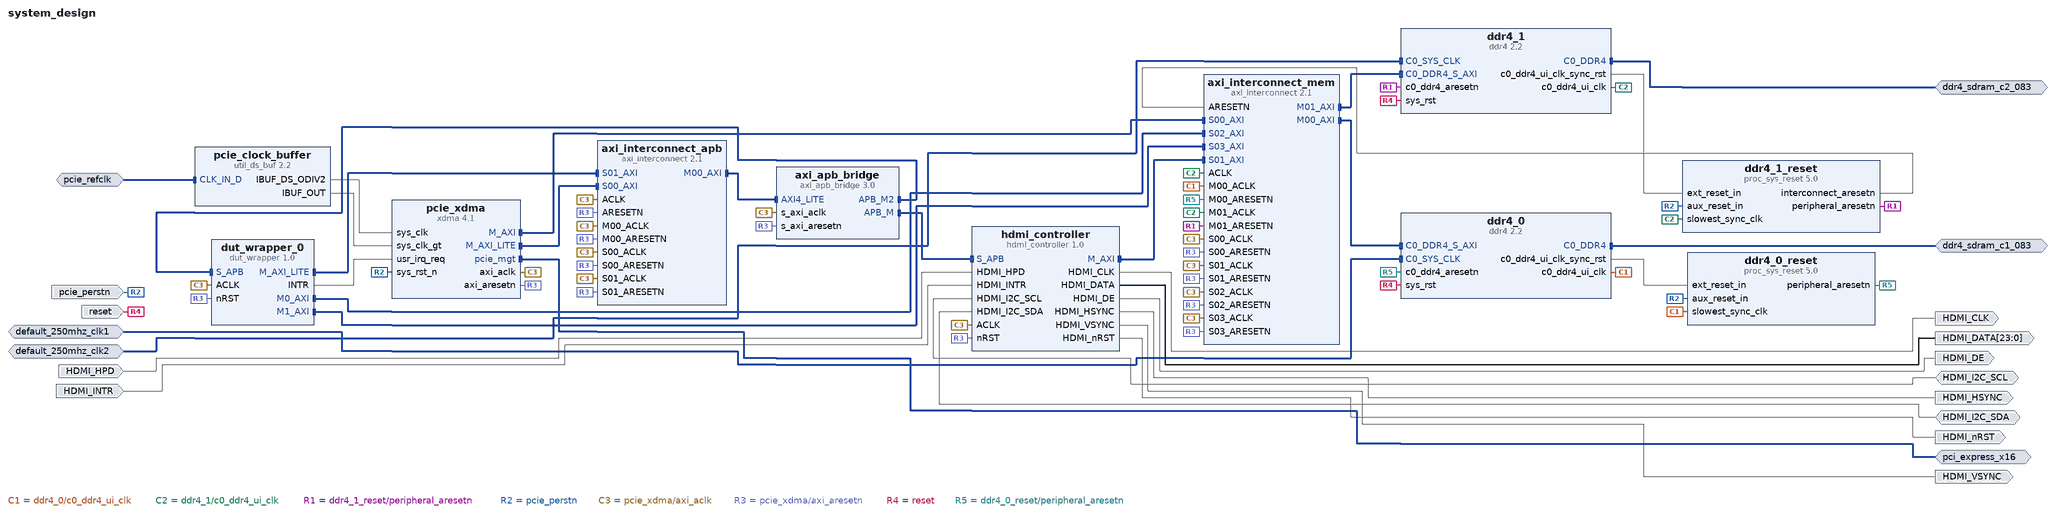
[diagram p0: block diagram of the top level]
# Vivado block design system_design, xcvu9p-flga2104-2L-e, Vivado 2024.2
create_bd_design system_design

create_bd_intf_port -mode Slave -vlnv xilinx.com:interface:diff_clock_rtl:1.0 pcie_refclk
set_property -dict {CONFIG.FREQ_HZ 100000000} [get_bd_intf_ports pcie_refclk]
create_bd_intf_port -mode Master -vlnv xilinx.com:interface:pcie_7x_mgt_rtl:1.0 pci_express_x16
create_bd_intf_port -mode Slave -vlnv xilinx.com:interface:diff_clock_rtl:1.0 default_250mhz_clk1
set_property -dict {CONFIG.FREQ_HZ 250000000} [get_bd_intf_ports default_250mhz_clk1]
create_bd_intf_port -mode Slave -vlnv xilinx.com:interface:diff_clock_rtl:1.0 default_250mhz_clk2
set_property -dict {CONFIG.FREQ_HZ 250000000} [get_bd_intf_ports default_250mhz_clk2]
create_bd_intf_port -mode Master -vlnv xilinx.com:interface:ddr4_rtl:1.0 ddr4_sdram_c1_083
create_bd_intf_port -mode Master -vlnv xilinx.com:interface:ddr4_rtl:1.0 ddr4_sdram_c2_083
create_bd_port -dir I -type rst pcie_perstn
set_property -dict {CONFIG.POLARITY ACTIVE_LOW} [get_bd_ports pcie_perstn]
create_bd_port -dir I -type rst reset
set_property -dict {CONFIG.POLARITY ACTIVE_HIGH} [get_bd_ports reset]
create_bd_port -dir I HDMI_INTR
create_bd_port -dir I HDMI_HPD
create_bd_port -dir O HDMI_nRST
create_bd_port -dir IO HDMI_I2C_SCL
create_bd_port -dir IO HDMI_I2C_SDA
create_bd_port -dir O HDMI_CLK
create_bd_port -dir O HDMI_DE
create_bd_port -dir O HDMI_HSYNC
create_bd_port -dir O HDMI_VSYNC
create_bd_port -dir O -from 23 -to 0 HDMI_DATA

create_bd_cell -type ip -vlnv xilinx.com:ip:xdma:4.1 pcie_xdma
set_property -dict [list \
  CONFIG.PCIE_BOARD_INTERFACE pci_express_x16 \
  CONFIG.PF0_DEVICE_ID_mqdma 903F \
  CONFIG.PF0_SRIOV_VF_DEVICE_ID A03F \
  CONFIG.PF2_DEVICE_ID_mqdma 923F \
  CONFIG.PF3_DEVICE_ID_mqdma 933F \
  CONFIG.SYS_RST_N_BOARD_INTERFACE pcie_perstn \
  CONFIG.axi_data_width 512_bit \
  CONFIG.axil_master_64bit_en false \
  CONFIG.axilite_master_en true \
  CONFIG.axilite_master_size 1 \
  CONFIG.axist_bypass_en false \
  CONFIG.axisten_freq 250 \
  CONFIG.cfg_mgmt_if false \
  CONFIG.mode_selection Advanced \
  CONFIG.pf0_base_class_menu Memory_controller \
  CONFIG.pf0_class_code_base 05 \
  CONFIG.pf0_class_code_interface 00 \
  CONFIG.pf0_class_code_sub 80 \
  CONFIG.pf0_device_id 7022 \
  CONFIG.pf0_msi_enabled false \
  CONFIG.pf0_sub_class_interface_menu Other_memory_controller \
  CONFIG.pf0_subsystem_id 2D3D \
  CONFIG.pf0_subsystem_vendor_id C10E \
  CONFIG.pl_link_cap_max_link_speed 8.0_GT/s \
  CONFIG.plltype QPLL1 \
  CONFIG.xdma_num_usr_irq 1 \
  CONFIG.xdma_pcie_64bit_en true \
  CONFIG.xdma_rnum_chnl 4 \
  CONFIG.xdma_wnum_chnl 4 \
] [get_bd_cells pcie_xdma]
create_bd_cell -type ip -vlnv xilinx.com:ip:util_ds_buf:2.2 pcie_clock_buffer
set_property -dict {CONFIG.DIFF_CLK_IN_BOARD_INTERFACE pcie_refclk CONFIG.USE_BOARD_FLOW true} [get_bd_cells pcie_clock_buffer]
create_bd_cell -type ip -vlnv xilinx.com:ip:ddr4:2.2 ddr4_0
set_property -dict [list \
  CONFIG.ADDN_UI_CLKOUT1_FREQ_HZ None \
  CONFIG.C0.BANK_GROUP_WIDTH 1 \
  CONFIG.C0.DDR4_AxiAddressWidth 31 \
  CONFIG.C0.DDR4_SAVE_RESTORE false \
  CONFIG.C0.DDR4_SELF_REFRESH false \
  CONFIG.C0_CLOCK_BOARD_INTERFACE default_250mhz_clk1 \
  CONFIG.C0_DDR4_BOARD_INTERFACE ddr4_sdram_c1_083 \
  CONFIG.RESET_BOARD_INTERFACE reset \
] [get_bd_cells ddr4_0]
create_bd_cell -type ip -vlnv xilinx.com:ip:proc_sys_reset:5.0 ddr4_0_reset
create_bd_cell -type ip -vlnv xilinx.com:ip:ddr4:2.2 ddr4_1
set_property -dict [list \
  CONFIG.ADDN_UI_CLKOUT1_FREQ_HZ None \
  CONFIG.C0.BANK_GROUP_WIDTH 1 \
  CONFIG.C0.DDR4_AxiAddressWidth 31 \
  CONFIG.C0_CLOCK_BOARD_INTERFACE default_250mhz_clk2 \
  CONFIG.C0_DDR4_BOARD_INTERFACE ddr4_sdram_c2_083 \
  CONFIG.RESET_BOARD_INTERFACE reset \
] [get_bd_cells ddr4_1]
create_bd_cell -type ip -vlnv xilinx.com:ip:proc_sys_reset:5.0 ddr4_1_reset
create_bd_cell -type ip -vlnv xilinx.com:ip:axi_interconnect:2.1 axi_interconnect_mem
set_property -dict [list \
  CONFIG.ENABLE_ADVANCED_OPTIONS 0 \
  CONFIG.M00_HAS_DATA_FIFO 1 \
  CONFIG.M00_HAS_REGSLICE 1 \
  CONFIG.M01_HAS_DATA_FIFO 1 \
  CONFIG.M01_HAS_REGSLICE 1 \
  CONFIG.NUM_MI 2 \
  CONFIG.NUM_SI 4 \
  CONFIG.S00_HAS_DATA_FIFO 1 \
  CONFIG.S00_HAS_REGSLICE 1 \
  CONFIG.S01_HAS_DATA_FIFO 1 \
  CONFIG.S01_HAS_REGSLICE 1 \
  CONFIG.S02_HAS_DATA_FIFO 1 \
  CONFIG.S02_HAS_REGSLICE 1 \
  CONFIG.S03_HAS_DATA_FIFO 1 \
  CONFIG.S03_HAS_REGSLICE 1 \
] [get_bd_cells axi_interconnect_mem]
create_bd_cell -type ip -vlnv xilinx.com:ip:axi_apb_bridge:3.0 axi_apb_bridge
set_property -dict {CONFIG.C_APB_NUM_SLAVES 2 CONFIG.C_M_APB_PROTOCOL apb3} [get_bd_cells axi_apb_bridge]
create_bd_cell -type ip -vlnv xilinx.com:user:dut_wrapper:1.0 dut_wrapper_0
set_property -dict [list \
  CONFIG.C_CLKIN_PERIOD 4 \
  CONFIG.C_M_AXILITE_ADDR_WIDTH 20 \
  CONFIG.C_M_AXI_ADDR_WIDTH 36 \
] [get_bd_cells dut_wrapper_0]
create_bd_cell -type ip -vlnv xilinx.com:user:hdmi_controller:1.0 hdmi_controller
set_property -dict {CONFIG.C_M_AXI_ADDR_WIDTH 36} [get_bd_cells hdmi_controller]
create_bd_cell -type ip -vlnv xilinx.com:ip:axi_interconnect:2.1 axi_interconnect_apb
set_property -dict {CONFIG.NUM_MI 1 CONFIG.NUM_SI 2} [get_bd_cells axi_interconnect_apb]

# ---- connections ----

connect_bd_intf_net [get_bd_intf_pins axi_interconnect_apb/S00_AXI] [get_bd_intf_pins pcie_xdma/M_AXI_LITE]
connect_bd_intf_net [get_bd_intf_pins axi_interconnect_mem/S01_AXI] [get_bd_intf_pins hdmi_controller/M_AXI]
connect_bd_intf_net [get_bd_intf_pins axi_apb_bridge/APB_M] [get_bd_intf_pins hdmi_controller/S_APB]
connect_bd_intf_net [get_bd_intf_pins dut_wrapper_0/S_APB] [get_bd_intf_pins axi_apb_bridge/APB_M2]
connect_bd_intf_net -intf_net axi_interconnect_0_M00_AXI [get_bd_intf_pins axi_interconnect_mem/M00_AXI] [get_bd_intf_pins ddr4_0/C0_DDR4_S_AXI]
connect_bd_intf_net -intf_net axi_interconnect_0_M00_AXI1 [get_bd_intf_pins axi_interconnect_apb/M00_AXI] [get_bd_intf_pins axi_apb_bridge/AXI4_LITE]
connect_bd_intf_net -intf_net axi_interconnect_0_M01_AXI [get_bd_intf_pins axi_interconnect_mem/M01_AXI] [get_bd_intf_pins ddr4_1/C0_DDR4_S_AXI]
connect_bd_intf_net [get_bd_intf_ports ddr4_sdram_c1_083] [get_bd_intf_pins ddr4_0/C0_DDR4]
connect_bd_intf_net [get_bd_intf_ports ddr4_sdram_c2_083] [get_bd_intf_pins ddr4_1/C0_DDR4]
connect_bd_intf_net -intf_net default_250mhz_clk1_1 [get_bd_intf_ports default_250mhz_clk1] [get_bd_intf_pins ddr4_0/C0_SYS_CLK]
connect_bd_intf_net -intf_net default_250mhz_clk2_1 [get_bd_intf_ports default_250mhz_clk2] [get_bd_intf_pins ddr4_1/C0_SYS_CLK]
connect_bd_intf_net [get_bd_intf_pins dut_wrapper_0/M0_AXI] [get_bd_intf_pins axi_interconnect_mem/S02_AXI]
connect_bd_intf_net [get_bd_intf_pins dut_wrapper_0/M1_AXI] [get_bd_intf_pins axi_interconnect_mem/S03_AXI]
connect_bd_intf_net [get_bd_intf_pins dut_wrapper_0/M_AXI_LITE] [get_bd_intf_pins axi_interconnect_apb/S01_AXI]
connect_bd_intf_net [get_bd_intf_ports pcie_refclk] [get_bd_intf_pins pcie_clock_buffer/CLK_IN_D]
connect_bd_intf_net [get_bd_intf_pins pcie_xdma/M_AXI] [get_bd_intf_pins axi_interconnect_mem/S00_AXI]
connect_bd_intf_net [get_bd_intf_ports pci_express_x16] [get_bd_intf_pins pcie_xdma/pcie_mgt]
connect_bd_net -net HDMI_HPD_0_1 [get_bd_ports HDMI_HPD] [get_bd_pins hdmi_controller/HDMI_HPD]
connect_bd_net -net HDMI_INTR_0_1 [get_bd_ports HDMI_INTR] [get_bd_pins hdmi_controller/HDMI_INTR]
connect_bd_net [get_bd_ports HDMI_I2C_SCL] [get_bd_pins hdmi_controller/HDMI_I2C_SCL]
connect_bd_net [get_bd_ports HDMI_I2C_SDA] [get_bd_pins hdmi_controller/HDMI_I2C_SDA]
connect_bd_net [get_bd_pins ddr4_0/c0_ddr4_ui_clk] [get_bd_pins axi_interconnect_mem/M00_ACLK] [get_bd_pins ddr4_0_reset/slowest_sync_clk]
connect_bd_net [get_bd_pins ddr4_0/c0_ddr4_ui_clk_sync_rst] [get_bd_pins ddr4_0_reset/ext_reset_in]
connect_bd_net [get_bd_pins ddr4_1/c0_ddr4_ui_clk] \
  [get_bd_pins axi_interconnect_mem/ACLK] [get_bd_pins axi_interconnect_mem/M01_ACLK] \
  [get_bd_pins ddr4_1_reset/slowest_sync_clk]
connect_bd_net [get_bd_pins ddr4_1/c0_ddr4_ui_clk_sync_rst] [get_bd_pins ddr4_1_reset/ext_reset_in]
connect_bd_net [get_bd_pins ddr4_1_reset/interconnect_aresetn] [get_bd_pins axi_interconnect_mem/ARESETN]
connect_bd_net [get_bd_pins ddr4_1_reset/peripheral_aresetn] [get_bd_pins axi_interconnect_mem/M01_ARESETN] [get_bd_pins ddr4_1/c0_ddr4_aresetn]
connect_bd_net [get_bd_pins dut_wrapper_0/INTR] [get_bd_pins pcie_xdma/usr_irq_req]
connect_bd_net [get_bd_pins hdmi_controller/HDMI_CLK] [get_bd_ports HDMI_CLK]
connect_bd_net [get_bd_pins hdmi_controller/HDMI_DATA] [get_bd_ports HDMI_DATA]
connect_bd_net [get_bd_pins hdmi_controller/HDMI_DE] [get_bd_ports HDMI_DE]
connect_bd_net [get_bd_pins hdmi_controller/HDMI_HSYNC] [get_bd_ports HDMI_HSYNC]
connect_bd_net [get_bd_pins hdmi_controller/HDMI_VSYNC] [get_bd_ports HDMI_VSYNC]
connect_bd_net [get_bd_pins hdmi_controller/HDMI_nRST] [get_bd_ports HDMI_nRST]
connect_bd_net [get_bd_pins pcie_clock_buffer/IBUF_DS_ODIV2] [get_bd_pins pcie_xdma/sys_clk]
connect_bd_net [get_bd_pins pcie_clock_buffer/IBUF_OUT] [get_bd_pins pcie_xdma/sys_clk_gt]
connect_bd_net [get_bd_ports pcie_perstn] \
  [get_bd_pins ddr4_0_reset/aux_reset_in] [get_bd_pins ddr4_1_reset/aux_reset_in] [get_bd_pins pcie_xdma/sys_rst_n]
connect_bd_net [get_bd_pins pcie_xdma/axi_aclk] \
  [get_bd_pins hdmi_controller/ACLK] [get_bd_pins dut_wrapper_0/ACLK] [get_bd_pins axi_apb_bridge/s_axi_aclk] \
  [get_bd_pins axi_interconnect_mem/S00_ACLK] [get_bd_pins axi_interconnect_mem/S01_ACLK] \
  [get_bd_pins axi_interconnect_mem/S02_ACLK] [get_bd_pins axi_interconnect_mem/S03_ACLK] \
  [get_bd_pins axi_interconnect_apb/ACLK] [get_bd_pins axi_interconnect_apb/S00_ACLK] \
  [get_bd_pins axi_interconnect_apb/M00_ACLK] [get_bd_pins axi_interconnect_apb/S01_ACLK]
connect_bd_net [get_bd_pins pcie_xdma/axi_aresetn] \
  [get_bd_pins hdmi_controller/nRST] [get_bd_pins dut_wrapper_0/nRST] [get_bd_pins axi_apb_bridge/s_axi_aresetn] \
  [get_bd_pins axi_interconnect_mem/S00_ARESETN] [get_bd_pins axi_interconnect_mem/S01_ARESETN] \
  [get_bd_pins axi_interconnect_mem/S02_ARESETN] [get_bd_pins axi_interconnect_mem/S03_ARESETN] \
  [get_bd_pins axi_interconnect_apb/ARESETN] [get_bd_pins axi_interconnect_apb/S00_ARESETN] \
  [get_bd_pins axi_interconnect_apb/M00_ARESETN] [get_bd_pins axi_interconnect_apb/S01_ARESETN]
connect_bd_net [get_bd_ports reset] [get_bd_pins ddr4_0/sys_rst] [get_bd_pins ddr4_1/sys_rst]
connect_bd_net -net system_reset_peripheral_aresetn [get_bd_pins ddr4_0_reset/peripheral_aresetn] \
  [get_bd_pins axi_interconnect_mem/M00_ARESETN] [get_bd_pins ddr4_0/c0_ddr4_aresetn]

# ---- address map ----
assign_bd_address -offset 0x800000000 -range 2G -target_address_space [get_bd_addr_spaces dut_wrapper_0/M0_AXI] [get_bd_addr_segs ddr4_0/C0_DDR4_MEMORY_MAP/C0_DDR4_ADDRESS_BLOCK]
assign_bd_address -offset 0x880000000 -range 2G -target_address_space [get_bd_addr_spaces dut_wrapper_0/M0_AXI] [get_bd_addr_segs ddr4_1/C0_DDR4_MEMORY_MAP/C0_DDR4_ADDRESS_BLOCK]
assign_bd_address -offset 0x10000 -range 64K -target_address_space [get_bd_addr_spaces dut_wrapper_0/M_AXI_LITE] [get_bd_addr_segs hdmi_controller/S_APB/S_APB]
assign_bd_address -offset 0x20000 -range 64K -target_address_space [get_bd_addr_spaces dut_wrapper_0/M_AXI_LITE] [get_bd_addr_segs dut_wrapper_0/S_APB/S_APB]
assign_bd_address -offset 0x800000000 -range 2G -target_address_space [get_bd_addr_spaces hdmi_controller/M_AXI] [get_bd_addr_segs ddr4_0/C0_DDR4_MEMORY_MAP/C0_DDR4_ADDRESS_BLOCK]
assign_bd_address -offset 0x880000000 -range 2G -target_address_space [get_bd_addr_spaces hdmi_controller/M_AXI] [get_bd_addr_segs ddr4_1/C0_DDR4_MEMORY_MAP/C0_DDR4_ADDRESS_BLOCK]
assign_bd_address -offset 0x0000000800000000 -range 2G -target_address_space [get_bd_addr_spaces pcie_xdma/M_AXI] [get_bd_addr_segs ddr4_0/C0_DDR4_MEMORY_MAP/C0_DDR4_ADDRESS_BLOCK]
assign_bd_address -offset 0x0000000880000000 -range 2G -target_address_space [get_bd_addr_spaces pcie_xdma/M_AXI] [get_bd_addr_segs ddr4_1/C0_DDR4_MEMORY_MAP/C0_DDR4_ADDRESS_BLOCK]
assign_bd_address -offset 0x00010000 -range 64K -target_address_space [get_bd_addr_spaces pcie_xdma/M_AXI_LITE] [get_bd_addr_segs hdmi_controller/S_APB/S_APB]
assign_bd_address -offset 0x00020000 -range 64K -target_address_space [get_bd_addr_spaces pcie_xdma/M_AXI_LITE] [get_bd_addr_segs dut_wrapper_0/S_APB/S_APB]

validate_bd_design
save_bd_design
